# EAGLE design NanoRemotev2 (EAGLE 6.1)
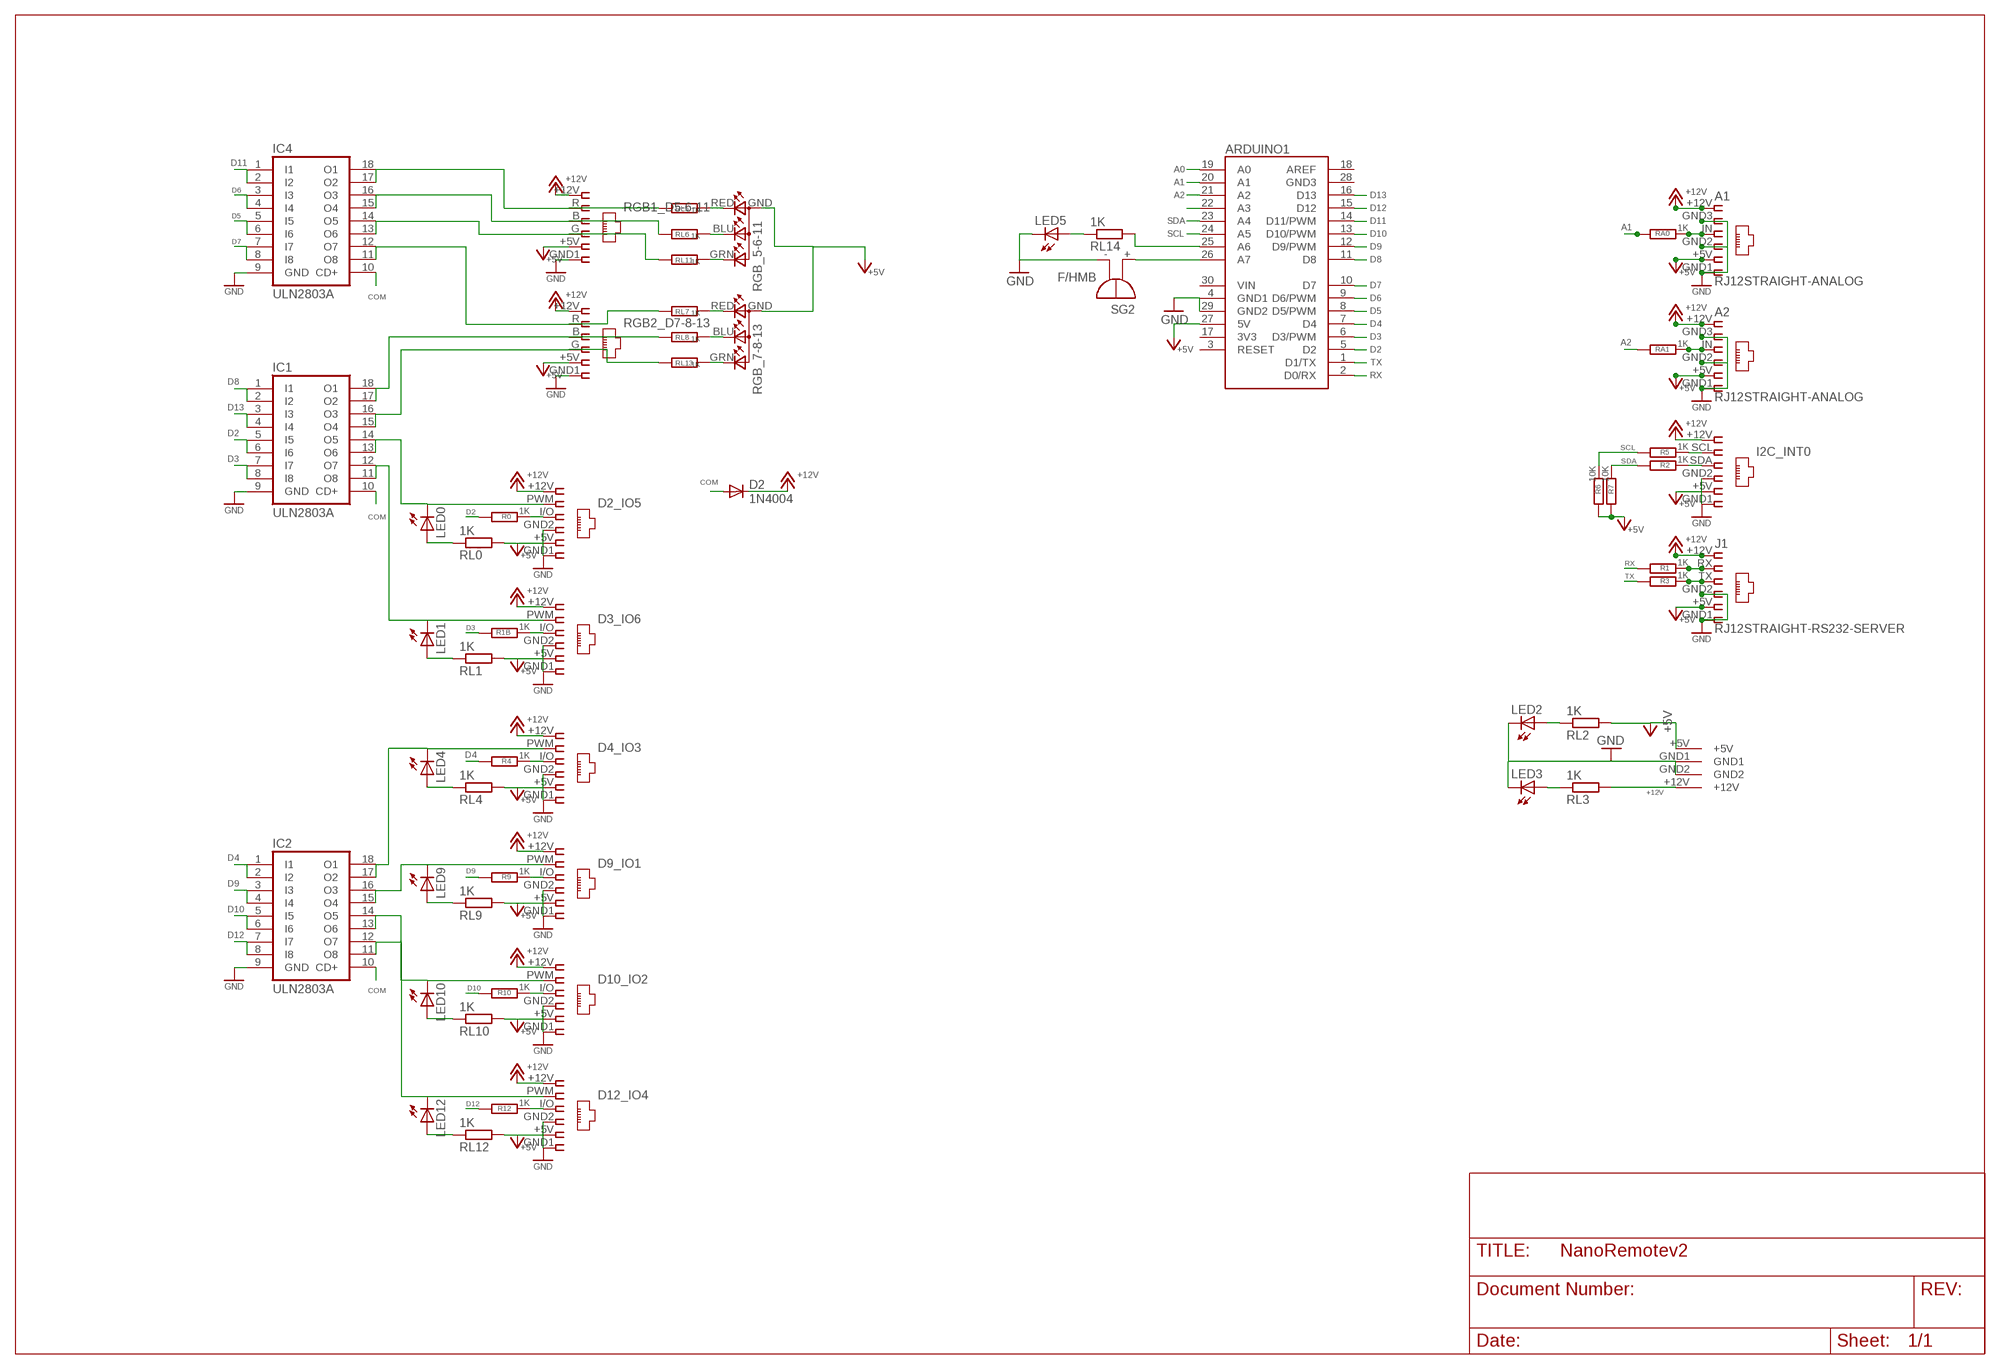
[diagram p0: schematic, sheet 1]

## Parts
A1  RJ12STRAIGHT-ANALOG  [RJ12-STRAIGHT-ANALOG]
A2  RJ12STRAIGHT-ANALOG  [RJ12-STRAIGHT-ANALOG]
ARDUINO1  ARDUINO_NANO  [ARDUINO_NANO]
D2  1N4004  [DO41-10]
D2_IO5  IO5  RJ12STRAIGHT  [RJ12-STRAIGHT]
D3_IO6  IO6  RJ12STRAIGHT  [RJ12-STRAIGHT]
D4_IO3  IO3  RJ12STRAIGHT  [RJ12-STRAIGHT]
D9_IO1  IO1  RJ12STRAIGHT  [RJ12-STRAIGHT]
D10_IO2  IO2  RJ12STRAIGHT  [RJ12-STRAIGHT]
D12_IO4  IO4  RJ12STRAIGHT  [RJ12-STRAIGHT]
I2C_INT0  I2C  RJ12STRAIGHT-I2C  [RJ12-STRAIGHT-I2C]
IC1  ULN2803A  [SO18W]
IC2  ULN2803A  [SO18W]
IC4  ULN2803A  [SO18W]
J1  RJ12STRAIGHT-RS232-SERVER  [RJ12-STRAIGHT-RS232]
LED0  LED3MM  [LED3MM]
LED1  LED3MM  [LED3MM]
LED2  LED3MM  [LED3MM]
LED3  LED3MM  [LED3MM]
LED4  LED3MM  [LED3MM]
LED5  LED3MM  [LED3MM]
LED9  LED3MM  [LED3MM]
LED10  LED3MM  [LED3MM]
LED12  LED3MM  [LED3MM]
R0  1K  R-EU_M1206  [M1206]
R1  1K  R-EU_M1206  [M1206]
R1B  1K  R-EU_M1206  [M1206]
R2  1K  R-EU_M1206  [M1206]
R3  1K  R-EU_M1206  [M1206]
R4  1K  R-EU_M1206  [M1206]
R5  1K  R-EU_M1206  [M1206]
R6  10K  R-EU_M1206  [M1206]
R7  10K  R-EU_M1206  [M1206]
R9  1K  R-EU_M1206  [M1206]
R10  1K  R-EU_M1206  [M1206]
R12  1K  R-EU_M1206  [M1206]
RA0  1K  R-EU_M1206  [M1206]
RA1  1K  R-EU_M1206  [M1206]
RGB1_D5-6-11  RGB1  RJ12STRAIGHT-RGB  [RJ12-STRAIGHT-RGB]
RGB2_D7-8-13  RGB2  RJ12STRAIGHT-RGB  [RJ12-STRAIGHT-RGB]
RGB_5-6-11  TOPLED-3  [LED-TRICOLOR-THROUGHHOLE]
RGB_7-8-13  TOPLED-3  [LED-TRICOLOR-THROUGHHOLE]
RL0  1K  R-EU_M1206  [M1206]
RL1  1K  R-EU_M1206  [M1206]
RL2  1K  R-EU_M1206  [M1206]
RL3  1K  R-EU_M1206  [M1206]
RL4  1K  R-EU_M1206  [M1206]
RL5  1K  R-EU_M1206  [M1206]
RL6  1K  R-EU_M1206  [M1206]
RL7  1K  R-EU_M1206  [M1206]
RL8  1K  R-EU_M1206  [M1206]
RL9  1K  R-EU_M1206  [M1206]
RL10  1K  R-EU_M1206  [M1206]
RL11  1K  R-EU_M1206  [M1206]
RL12  1K  R-EU_M1206  [M1206]
RL13  1K  R-EU_M1206  [M1206]
RL14  1K  R-EU_M1206  [M1206]
SG2  F/HMB  [F/HMB]
U$1  KPJX-4S-S  [KPJX-4S-S]

## Nets
+5V [highpower]: A1.+5V A2.+5V ARDUINO1.27(5V) D2_IO5.+5V D3_IO6.+5V D4_IO3.+5V D9_IO1.+5V D10_IO2.+5V D12_IO4.+5V I2C_INT0.+5V J1.+5V R6.2 R7.2 RGB1_D5-6-11.+5V RGB2_D7-8-13.+5V RGB_5-6-11.GND(A2) RGB_7-8-13.GND(A2) RL0.2 RL1.2 RL2.2 RL4.2 RL9.2 RL10.2 RL12.2 U$1.+5V
+12V [highpower]: A1.+12V A2.+12V D2.C D2_IO5.+12V D3_IO6.+12V D4_IO3.+12V D9_IO1.+12V D10_IO2.+12V D12_IO4.+12V I2C_INT0.+12V J1.+12V RGB1_D5-6-11.+12V RGB2_D7-8-13.+12V RL3.2 U$1.+12V
A0: ARDUINO1.19(A0)
A1: ARDUINO1.20(A1) RA0.2
A2: ARDUINO1.21(A2) RA1.2
COM: D2.A IC1.10(CD+) IC2.10(CD+) IC4.10(CD+)
D2: ARDUINO1.5(D2) IC1.5(I5) IC1.6(I6) R0.2
D2B: D4_IO3.I/O R4.1
D2B1: D9_IO1.I/O R9.1
D2B2: D10_IO2.I/O R10.1
D2B3: D12_IO4.I/O R12.1
D2B4: I2C_INT0.SDA R2.1
D2B5: J1.TX R3.1
D2B6: D2_IO5.I/O R0.1
D2B7: D3_IO6.I/O R1B.1
D2B8: A1.IN RA0.1
D2B9: A2.IN RA1.1
D3: ARDUINO1.6(D3/PWM) IC1.7(I7) IC1.8(I8) R1B.2
D4: ARDUINO1.7(D4) IC2.1(I1) IC2.2(I2) R4.2
D5: ARDUINO1.8(D5/PWM) IC4.5(I5) IC4.6(I6)
D6: ARDUINO1.9(D6/PWM) IC4.3(I3) IC4.4(I4)
D7: ARDUINO1.10(D7) IC4.7(I7) IC4.8(I8)
D8: ARDUINO1.11(D8) IC1.1(I1) IC1.2(I2)
D9: ARDUINO1.12(D9/PWM) IC2.3(I3) IC2.4(I4) R9.2
D10: ARDUINO1.13(D10/PWM) IC2.5(I5) IC2.6(I6) R10.2
D11: ARDUINO1.14(D11/PWM) IC4.1(I1) IC4.2(I2)
D12: ARDUINO1.15(D12) IC2.7(I7) IC2.8(I8) R12.2
D13: ARDUINO1.16(D13) IC1.3(I3) IC1.4(I4)
GND [highpower]: A1.GND1 A1.GND2 A1.GND3 A2.GND1 A2.GND2 A2.GND3 ARDUINO1.4(GND1) ARDUINO1.29(GND2) D2_IO5.GND1 D2_IO5.GND2 D3_IO6.GND1 D3_IO6.GND2 D4_IO3.GND1 D4_IO3.GND2 D9_IO1.GND1 D9_IO1.GND2 D10_IO2.GND1 D10_IO2.GND2 D12_IO4.GND1 D12_IO4.GND2 I2C_INT0.GND1 I2C_INT0.GND2 IC1.9(GND) IC2.9(GND) IC4.9(GND) J1.GND1 J1.GND2 LED2.K(C) LED3.K(C) LED5.K(C) RGB1_D5-6-11.GND1 RGB2_D7-8-13.GND1 SG2.- U$1.GND1 U$1.GND2
N$1: RGB_5-6-11.RED(CRED) RL5.2
N$2: RGB_5-6-11.BLU(CBLUE) RL6.2
N$3 [power]: IC1.17(O2) IC1.18(O1) RGB2_D7-8-13.B RL8.1
N$4: RGB_5-6-11.GRN(CGREEN) RL11.2
N$5 [power]: IC4.17(O2) IC4.18(O1) RGB1_D5-6-11.R RL5.1
N$6 [power]: IC4.15(O4) IC4.16(O3) RGB1_D5-6-11.B RL6.1
N$7: J1.RX R1.1
N$8: I2C_INT0.SCL R5.1
N$9: RGB_7-8-13.RED(CRED) RL7.2
N$10: LED5.A RL14.1
N$11: RGB_7-8-13.BLU(CBLUE) RL8.2
N$12: LED9.A RL9.1
N$13: LED3.A RL3.1
N$14: RGB_7-8-13.GRN(CGREEN) RL13.2
N$15: LED4.A RL4.1
N$16: ARDUINO1.22(A3)
N$17 [power]: IC4.13(O6) IC4.14(O5) RGB1_D5-6-11.G RL11.1
N$18 [power]: D4_IO3.PWM IC2.17(O2) IC2.18(O1) LED4.K(C)
N$19 [power]: IC4.11(O8) IC4.12(O7) RGB2_D7-8-13.R RL7.1
N$20: ARDUINO1.25(A6) RL14.2
N$21: LED10.A RL10.1
N$22: ARDUINO1.26(A7) SG2.+
N$23: LED2.A RL2.1
N$24 [power]: D10_IO2.PWM IC2.13(O6) IC2.14(O5) LED10.K(C)
N$28: LED12.A RL12.1
N$29 [power]: IC1.15(O4) IC1.16(O3) RGB2_D7-8-13.G RL13.1
N$35 [power]: D3_IO6.PWM IC1.11(O8) IC1.12(O7) LED1.K(C)
N$38: LED0.A RL0.1
N$40 [power]: D2_IO5.PWM IC1.13(O6) IC1.14(O5) LED0.K(C)
N$41: LED1.A RL1.1
N$42 [power]: D9_IO1.PWM IC2.15(O4) IC2.16(O3) LED9.K(C)
N$44 [power]: D12_IO4.PWM IC2.11(O8) IC2.12(O7) LED12.K(C)
RX: ARDUINO1.2(D0/RX) R1.2
SCL: ARDUINO1.24(A5) R5.2 R6.1
SDA: ARDUINO1.23(A4) R2.2 R7.1
TX: ARDUINO1.1(D1/TX) R3.2
Unconnected: ARDUINO1.3(RESET) ARDUINO1.18(AREF) ARDUINO1.28(GND3) ARDUINO1.30(VIN)

## Power pins joined to a net without a drawn wire
3V3: ARDUINO1.17(3V3)

## Library data of the parts
A1 A2 D2_IO5 D3_IO6 D4_IO3 D9_IO1 D10_IO2 D12_IO4 I2C_INT0 J1 RGB1_D5-6-11 RGB2_D7-8-13 = lpatiny:RJ12: CORCOM Modular RJ Jacks No Shield Source: www.tycoelectronics.com .. ENG_DS_1654001_1099_RJ_L_0507.pdf
ARDUINO1 = arduino:ARDUINO_NANO: Arduino Nano I/O pin arrangement
D2 = diode:1N4004: DIODE general purpose rectifier, 1 A
IC1 IC2 IC4 = lpatiny:ULN2803A: DRIVER ARRAY
LED0 LED1-LED5 LED9 LED10 LED12 = lpatiny:LED3MM
R0 R1 R1B R2-R7 R9 R10 R12 RA0 RA1 RL0 RL1-RL14 = resistor:R-EU_: RESISTOR, European symbol
RGB_5-6-11 RGB_7-8-13 = lpatiny:TOPLED-3: OSRAM - Hyper Multi TOPLED® (RGB) LB E673, LV E673, LT E673 - Power TOPLED® Enhanced optical Power LED (HOP2000) LS E67B, LA E67B, LO E67B, LY E67B - Hyper Multi TOPLED® Enhanced optical Power LED (HOP2000 / ATON®) LATB T66B - Hyper Multi TOPLED® Hyper-Bright LED LATB T686 Source: http://www.osram.convergy.de/
SG2 = buzzer:F/HMB: BUZZER Source: Buerklin; OC_FARNELL: unknown; OC_NEWARK: unknown
U$1 = lpatiny:KPJX-4S-S

## Net classes
0 default: width 0.457 mm
1 power: width 0.914 mm
2 highpower: width 1.372 mm

## Board
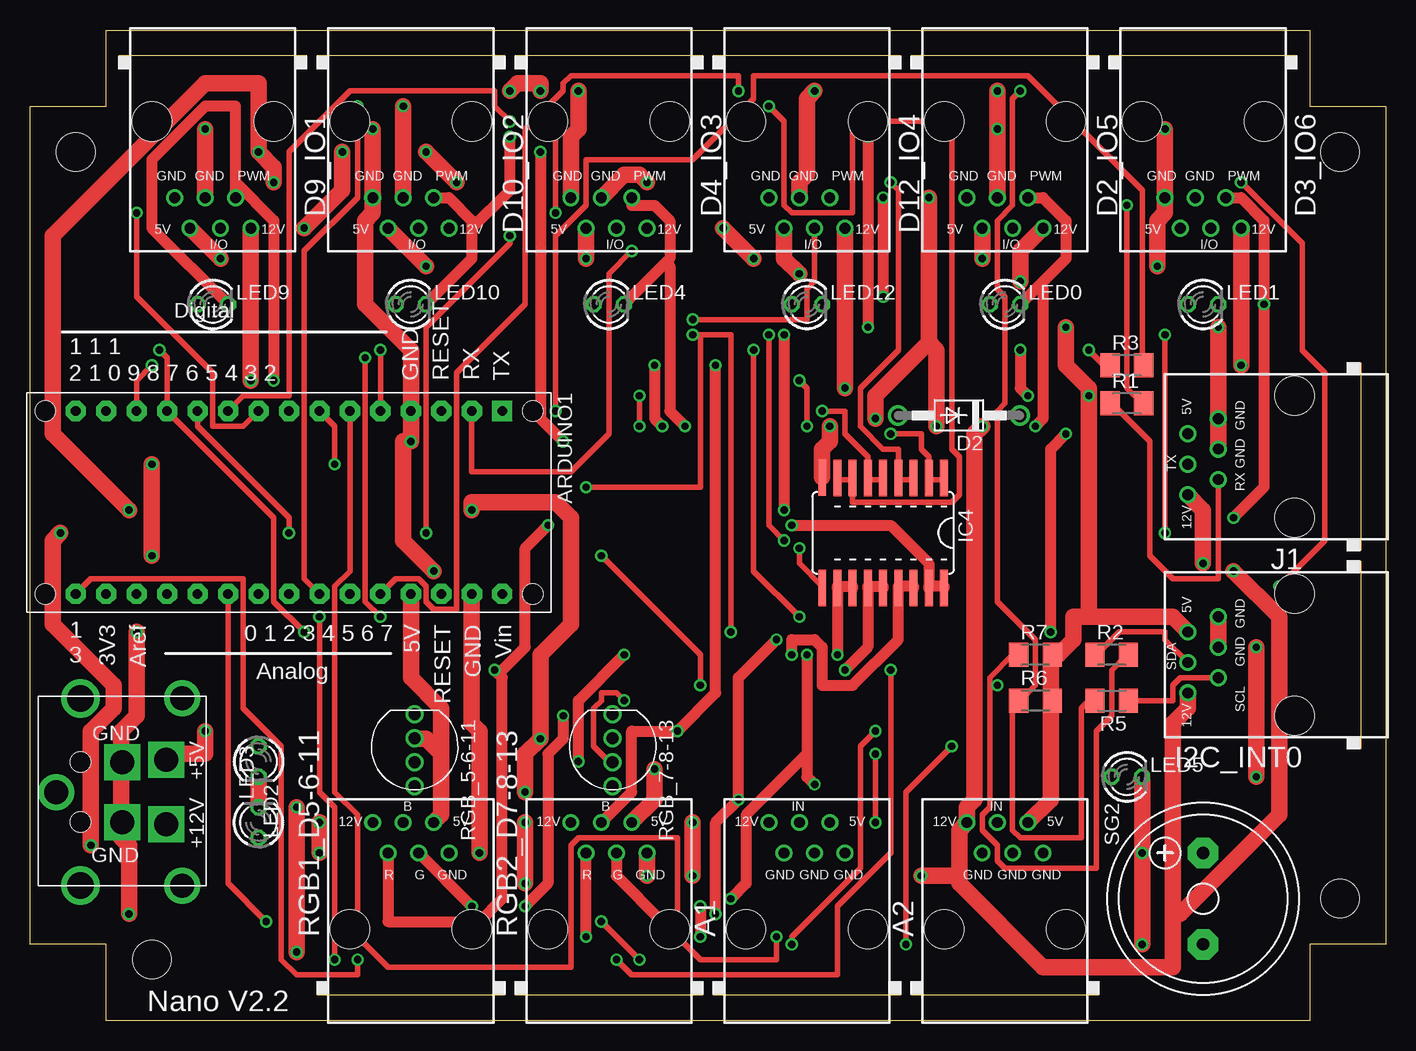
[diagram p1: board, top side]
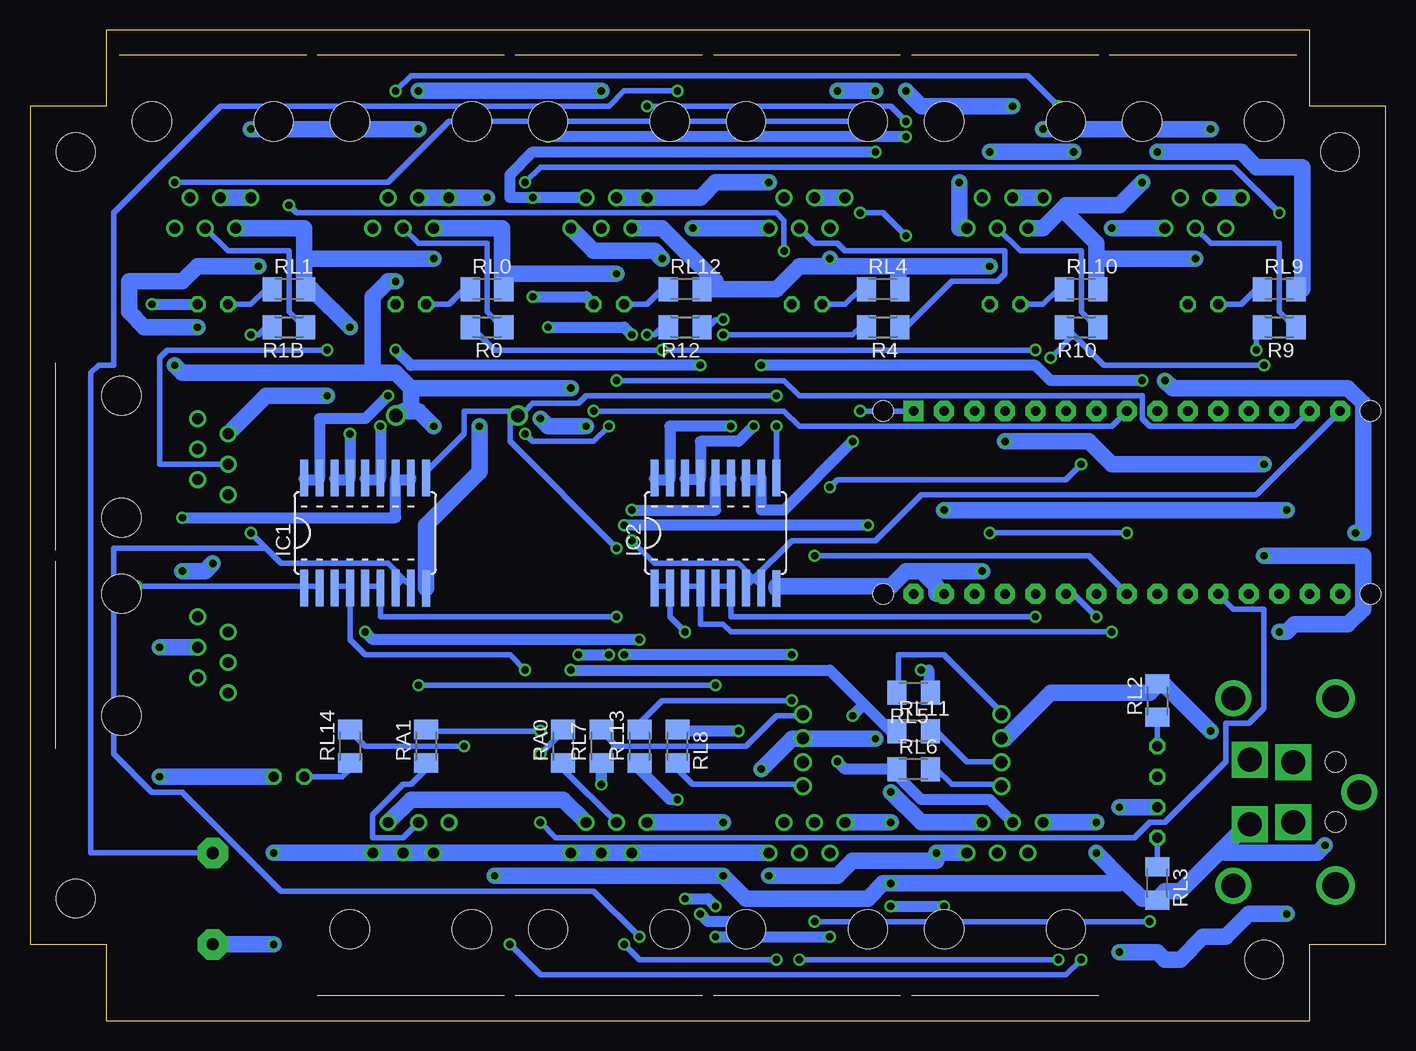
[diagram p2: board, bottom side, seen from below]

Size 113.03 x 82.55 mm. Coordinates in mm from the lower left corner, seen from the top.
Outline: 6.35,82.55 106.68,82.55 106.68,76.2 113.03,76.2 113.03,6.35 106.68,6.35 106.68,0 6.35,0 6.35,6.35 0,6.35 0,76.2 6.35,76.2 6.35,82.55
Copper layers (1*16): Top 0.035mm / dielectric 1.5mm / Bottom 0.035mm
Design rules: minimum track width 10mil, minimum drill 24mil, track to track 8mil, track to pad 8mil, pad to pad 8mil, via to via 8mil, smd to smd 8mil, copper to edge 40mil, drill to drill 8mil, minimum pad ring 10mil, minimum via ring 8mil, stop-mask expansion 4mil, vias tented up to drill 0mil, thermal gap 10mil
Holes 3.2 mm at 3.81,72.39 10.16,5.08 109.22,10.16 109.22,72.39
tRestrict: area 106.7,57.1 to 113,68.6
bRestrict: area 106.7,57.1 to 113,68.6
vRestrict: area 49.5,33 to 62.2,48.3; area 64.8,33 to 77.5,48.3; area 78.7,33 to 91.4,48.3; area 106.7,57.1 to 113,68.6
Milling: 12 lines

### Footprints (pad centres in the part's own frame; a part is rotated, then mirrored left to right if it is on the bottom)
RJ12-STRAIGHT-ANALOG = drill 0.9 pad 1.4: +5V 1.905,8.89; +12V -3.175,8.89; GND1 3.175,6.35; GND2 0.635,6.35; GND3 -1.905,6.35; IN -0.635,8.89 | hole 3.251: -5.08,0; 5.08,0
ARDUINO_NANO = drill 0.8 pad 1.676 square: 1 0,-2.54 | drill 0.8 pad 1.676 octagon: 2 0,-5.08; 3 0,-7.62; 4 0,-10.16; 5 0,-12.7; 6 0,-15.24; 7 0,-17.78; 8 0,-20.32; 9 0,-22.86; 10 0,-25.4; 11 0,-27.94; 12 0,-30.48; 13 0,-33.02; 14 0,-35.56; 15 0,-38.1; 16 15.24,-38.1; 17 15.24,-35.56; 18 15.24,-33.02; 19 15.24,-30.48; 20 15.24,-27.94; 21 15.24,-25.4; 22 15.24,-22.86; 23 15.24,-20.32; 24 15.24,-17.78; 25 15.24,-15.24; 26 15.24,-12.7; 27 15.24,-10.16; 28 15.24,-7.62; 29 15.24,-5.08; 30 15.24,-2.54 | hole 1.676: 0,0; 0,-40.64; 15.24,-40.64; 15.24,0
DO41-10 = drill 1.118: A 5.08,0; C -5.08,0
RJ12-STRAIGHT@1 = drill 0.9 pad 1.4: +5V 1.905,8.89; +12V -3.175,8.89; GND1 3.175,6.35; GND2 0.635,6.35; I/O -0.635,8.89; PWM -1.905,6.35 | hole 3.251: -5.08,0; 5.08,0
RJ12-STRAIGHT-I2C@1 = drill 0.9 pad 1.4: +5V 1.905,8.89; +12V -3.175,8.89; GND1 3.175,6.35; GND2 0.635,6.35; SCL -1.905,6.35; SDA -0.635,8.89 | hole 3.251: -5.08,0; 5.08,0
SO18W = smd 0.66 x 3.048: 1 -5.08,-4.585; 2 -3.81,-4.585; 3 -2.54,-4.585; 4 -1.27,-4.585; 5 0,-4.585; 6 1.27,-4.585; 7 2.54,-4.585; 8 3.81,-4.585; 9 5.08,-4.623; 10 5.08,4.585; 11 3.81,4.585; 12 2.54,4.585; 13 1.27,4.585; 14 0,4.585; 15 -1.27,4.585; 16 -2.54,4.585; 17 -3.81,4.585; 18 -5.08,4.585
RJ12-STRAIGHT-RS232 = drill 0.9 pad 1.4: +5V 1.905,8.89; +12V -3.175,8.89; GND1 3.175,6.35; GND2 0.635,6.35; RX -1.905,6.35; TX -0.635,8.89 | hole 3.251: -5.08,0; 5.08,0
LED3MM = drill 0.813 octagon: A -1.27,0; K 1.27,0
M1206 = smd 1.6 x 2: 1 -1.4,0; 2 1.4,0
RJ12-STRAIGHT-RGB@1 = drill 0.9 pad 1.4: +5V 1.905,8.89; +12V -3.175,8.89; B -0.635,8.89; G 0.635,6.35; GND1 3.175,6.35; R -1.905,6.35 | hole 3.251: -5.08,0; 5.08,0
LED-TRICOLOR-THROUGHHOLE = drill 1: BLU 3,0; GND -1,0; GRN 1,0; RED -3,0
F/HMB = drill 1.016 pad 2.54 octagon: + 3.81,0; - -3.81,0
KPJX-4S-S = drill 2 square: +5V 2.7,1.35; +12V -2.7,1.35; GND1 -2.5,5; GND2 2.5,5 | drill 2: P$1 -7.8,0; P$2 7.8,0; P$11 0,10.5 | drill 2.2: P$3 -7.8,8.5; P$4 7.8,8.5 | hole 1.7: -2.5,8.5; 2.5,8.5

### Placement (x,y rotation side)
A1  64.77,7.62 0 top
A2  81.28,7.62 0 top
ARDUINO1  41.91,50.8 270 top
D2  77.44,50.43 180 top
D2_IO5  IO5  [RJ12-STRAIGHT@1]  81.28,74.93 180 top
D3_IO6  IO6  [RJ12-STRAIGHT@1]  97.79,74.93 180 top
D4_IO3  IO3  [RJ12-STRAIGHT@1]  48.26,74.93 180 top
D9_IO1  IO1  [RJ12-STRAIGHT@1]  15.24,74.93 180 top
D10_IO2  IO2  [RJ12-STRAIGHT@1]  31.75,74.93 180 top
D12_IO4  IO4  [RJ12-STRAIGHT@1]  64.77,74.93 180 top
I2C_INT0  I2C  [RJ12-STRAIGHT-I2C@1]  105.41,30.48 90 top
IC1  85.09,40.64 0 bottom
IC2  55.88,40.64 0 bottom
IC4  71.12,40.64 180 top
J1  105.41,46.99 90 top
LED0  81.28,59.69 0 top
LED1  97.79,59.69 0 top
LED2  19.05,21.59 270 top
LED3  19.05,16.51 90 top
LED4  48.26,59.69 0 top
LED5  91.44,20.32 0 top
LED9  15.24,59.69 0 top
LED10  31.75,59.69 0 top
LED12  64.77,59.69 0 top
R0  74.93,57.78 180 bottom
R1  91.44,51.44 0 top
R1B  91.44,57.78 180 bottom
R2  90.17,30.48 0 top
R3  91.44,54.61 0 top
R4  41.91,57.78 180 bottom
R5  90.17,26.67 180 top
R6  83.82,26.67 0 top
R7  83.82,30.48 0 top
R9  8.89,57.78 180 bottom
R10  25.4,57.78 180 bottom
R12  58.42,57.78 180 bottom
RA0  68.58,22.86 90 bottom
RA1  80.01,22.86 90 bottom
RGB1_D5-6-11  RGB1  [RJ12-STRAIGHT-RGB@1]  31.75,7.62 0 top
RGB2_D7-8-13  RGB2  [RJ12-STRAIGHT-RGB@1]  48.26,7.62 0 top
RGB_5-6-11  32.07,22.54 270 top
RGB_7-8-13  48.58,22.54 270 top
RL0  74.93,60.96 0 bottom
RL1  91.44,60.96 0 bottom
RL2  19.05,26.67 90 bottom
RL3  19.05,11.43 270 bottom
RL4  41.91,60.96 0 bottom
RL5  39.37,27.3 180 bottom
RL6  39.37,20.95 0 bottom
RL7  65.41,22.86 90 bottom
RL8  59.05,22.86 270 bottom
RL9  8.89,60.96 0 bottom
RL10  25.4,60.96 0 bottom
RL11  39.37,24.13 0 bottom
RL12  58.42,60.96 0 bottom
RL13  62.23,22.86 90 bottom
RL14  86.36,22.86 90 bottom
SG2  97.79,10.16 90 top
U$1  12.7,19.05 90 top

### Tracks (layer width: path | path; a pad name or v marks a point on that pad's centre or on a via)
+5V  (via drill 0.61)
  Top 1.372: I2C_INT0.+5V 95.25,33.66 88.27,33.66 | 88.27,33.66 86.99,33.66 86.99,31.75 85.72,30.48 R7.2 85.09,30.48 85.09,26.67 R6.2 85.09,26.04 85.09,18.41 A2.+5V | 88.27,33.66 v88.27,52.07 88.27,52.7 86.36,54.61 v86.36,57.78 | RGB2_D7-8-13.+5V 52.07,18.41 v52.07,20.95 | RGB1_D5-6-11.+5V 34.29,17.14 34.29,22.23 | 34.29,22.23 33.02,23.5 32.38,23.5 RGB_5-6-11.GND | ARDUINO1.27 31.75,28.57 34.29,26.04 34.29,22.23 | v41.28,19.05 41.28,22.23 v42.55,23.5 42.55,30.48 45.09,33.02 45.09,41.91 43.82,43.18 36.83,43.18 v36.83,42.55 | v14.61,24.13 14.61,22.23 11.43,22.23 U$1.+5V | v79.38,63.5 D2_IO5.+5V | v46.36,63.5 D4_IO3.+5V | v20.32,69.85 20.32,71.12 v19.05,72.39 19.05,78.11 14.61,78.11 1.91,65.41 1.91,48.9 v8.26,42.55 | v15.88,63.5 D9_IO1.+5V | D10_IO2.+5V v33.02,62.87 | v64.14,62.23 62.87,63.5 D12_IO4.+5V
  Bottom 1.372: A1.+5V 68.58,18.41 81.28,18.41 A2.+5V | J1.+5V 93.34,52.07 v88.27,52.07 | v52.07,20.95 49.53,23.5 48.9,23.5 RGB_7-8-13.GND 48.26,23.5 v42.55,23.5 | RGB_5-6-11.GND 31.75,23.5 27.94,27.3 19.68,27.3 19.05,27.94 RL2.2 18.41,27.94 v14.61,24.13 | v41.28,19.05 38.74,16.51 RGB1_D5-6-11.+5V | 73.66,62.23 73.66,66.04 D2_IO5.+5V | 73.66,62.23 73.66,60.96 RL0.2 | 90.17,63.5 90.17,66.04 D3_IO6.+5V | 90.17,63.5 90.17,60.96 RL1.2 89.53,60.96 v86.36,57.78 | 90.17,63.5 v79.38,63.5 | 40.64,62.87 40.64,60.96 RL4.2 | 46.36,62.87 48.9,62.87 50.8,60.96 55.88,60.96 | 46.36,62.87 40.64,62.87 | RL12.2 55.88,60.96 | v46.36,63.5 46.36,62.87 | D12_IO4.+5V 60.33,66.04 55.88,61.59 55.88,60.96 | v19.05,72.39 12.06,72.39 10.79,71.12 6.98,71.12 6.98,60.96 RL9.2 | v20.32,69.85 22.22,67.94 26.67,67.94 | 26.67,67.94 28.57,66.04 D10_IO2.+5V | 24.13,63.5 24.13,64.77 26.67,67.31 26.67,67.94 | 24.13,63.5 24.13,60.96 RL10.2 | 24.13,63.5 v15.88,63.5 | v33.02,62.87 40.64,62.87 | v64.14,62.23 73.66,62.23 | v8.26,42.55 v36.83,42.55
+12V  (via drill 0.61)
  Top 1.372: v60.33,63.5 v57.79,66.04 | D2_IO5.+12V 82.55,64.14 v82.55,61.59 | v100.96,54.61 D3_IO6.+12V | v67.94,52.7 D12_IO4.+12V | 77.47,12.06 77.47,11.43 84.45,4.45 95.25,4.45 95.25,8.89 | 77.47,12.06 77.47,15.88 A2.+12V 78.1,17.78 78.74,18.41 78.74,48.9 v79.38,49.53 | 95.25,8.89 95.25,24.77 96.52,26.04 I2C_INT0.+12V | J1.+12V 97.79,42.55 v97.79,38.1 | v100.33,37.47 104.14,33.66 104.14,17.14 95.88,8.89 95.25,8.89 | v22.86,66.04 26.04,69.22 v26.04,72.39 | v35.56,69.85 v33.02,72.39 | v24.13,13.97 v24.13,16.51 | v41.28,11.43 v41.28,16.51 | v55.25,12.06 v55.25,16.51 | v18.41,53.34 D9_IO1.+12V | v2.54,40.64 1.91,40.01 1.91,33.02 6.98,27.94 6.98,26.04 5.08,24.13 v5.08,14.61 | v74.3,12.06 77.47,12.06
  Bottom 1.372: v57.79,66.04 D4_IO3.+12V | v60.33,63.5 60.96,64.14 66.04,64.14 D12_IO4.+12V | v82.55,61.59 83.19,61.59 84.45,60.33 84.45,53.98 | 84.45,53.98 82.55,53.98 81.28,52.7 | 81.28,50.8 81.28,52.7 | 81.28,50.8 81.91,50.8 D2.C | v100.96,54.61 100.33,53.98 84.45,53.98 | 81.28,52.7 v67.94,52.7 | v97.79,38.1 98.42,37.47 v100.33,37.47 | v22.86,66.04 D9_IO1.+12V | v33.02,72.39 v26.04,72.39 | v35.56,69.85 35.56,66.04 D10_IO2.+12V | 13.65,14.29 12.06,15.88 11.43,15.88 U$1.+12V | 13.65,14.29 17.14,10.79 18.41,10.79 19.05,10.16 RL3.2 19.68,10.16 20.32,10.16 21.91,11.75 | v24.13,16.51 RGB1_D5-6-11.+12V | 21.91,11.75 v24.13,13.97 | v41.28,16.51 RGB2_D7-8-13.+12V | 21.91,11.75 22.22,11.43 v41.28,11.43 41.91,11.43 43.18,10.16 53.34,10.16 v55.25,12.06 v74.3,12.06 | v55.25,16.51 A1.+12V | v18.41,53.34 17.78,52.7 3.17,52.7 1.91,51.44 1.91,40.64 v2.54,40.64 | v5.08,14.61 5.71,13.97 13.33,13.97 13.65,14.29 | v79.38,49.53 80.64,50.8 81.28,50.8
A1  (via drill 0.61)
  Top 0.457: v70.48,16.51 v70.48,22.23
  Bottom 0.457: v70.48,22.23 68.58,24.13 RA0.2 | v70.48,16.51 69.21,15.24 20.95,15.24 19.68,16.51 18.41,16.51 13.33,21.59 13.33,24.77 11.43,24.77 10.16,26.04 10.16,34.29 12.7,34.29 ARDUINO1.20
A2  (via drill 0.61)
  Top 0.457: v70.48,24.13 69.21,22.86 69.21,12.7 63.5,6.99 v63.5,6.35 | v47.62,8.26 v50.8,5.08 | v19.68,8.26 16.51,11.43 ARDUINO1.21
  Bottom 0.457: v70.48,24.13 80.01,24.13 RA1.2 | v63.5,6.35 62.23,5.08 v50.8,5.08 | v19.68,8.26 v47.62,8.26
COM  (via drill 0.61)
  Top 0.457: v50.8,52.07 v50.8,49.53 | v64.14,39.37 64.14,38.1 66.04,36.2 IC4.10
  Bottom 0.457: v50.8,49.53 IC2.10 | v50.8,52.07 66.67,52.07 67.31,51.44 71.12,51.44 71.75,50.8 D2.A | v64.14,39.37 73.02,48.26 73.02,50.16 72.39,50.16 D2.A | IC1.10 80.01,45.72 76.83,48.9 76.83,50.8 72.39,50.8 D2.A
D2  (via drill 0.61)
  Top 0.457: ARDUINO1.5 v29.21,55.88 | v64.14,33.66 60.33,37.47 v60.33,55.88
  Bottom 0.457: IC1.5 85.09,36.2 83.82,36.2 IC1.6 83.82,33.66 v64.14,33.66 | v29.21,55.88 v60.33,55.88 74.3,55.88 76.2,57.78 R0.2
D2B
  Bottom 0.457: D4_IO3.I/O 47.62,64.77 45.72,64.77 45.09,64.14 31.75,64.14 31.75,62.23 32.38,61.59 36.2,61.59 40.01,57.78 R4.1
D2B1
  Bottom 0.457: D9_IO1.I/O 14.61,64.77 8.89,64.77 8.89,59.05 7.62,57.78 R9.1
D2B2
  Bottom 0.457: D10_IO2.I/O 30.48,64.14 25.4,64.14 25.4,59.05 24.13,57.78 R10.1
D2B3  (via drill 0.61)
  Top 0.457: v55.25,58.42 64.77,58.42 64.77,60.96 65.41,61.59 D12_IO4.I/O
  Bottom 0.457: v55.25,58.42 55.88,58.42 56.52,57.78 R12.1
D2B4
  Top 0.457: I2C_INT0.SDA 94.61,31.75 94.61,32.38 90.8,32.38 88.9,30.48 R2.1
D2B5  (via drill 0.61)
  Top 0.457: v88.27,55.88 89.53,54.61 R3.1
  Bottom 0.457: v88.27,55.88 101.6,55.88 102.23,55.24 102.23,46.35 J1.TX
D2B6
  Bottom 0.457: D2_IO5.I/O 80.64,64.77 74.93,64.77 74.93,59.05 73.66,57.78 R0.1
D2B7
  Bottom 0.457: D3_IO6.I/O 96.52,64.14 91.44,64.14 91.44,59.05 90.17,57.78 R1B.1
D2B8
  Bottom 0.457: A1.IN 68.58,20.95 RA0.1
D2B9
  Bottom 0.457: A2.IN 81.91,15.24 84.45,15.24 84.45,17.14 81.91,19.68 81.28,19.68 80.01,20.95 RA1.1
D3  (via drill 0.61)
  Top 0.457: v94.61,40.64 v94.61,57.15 | ARDUINO1.6 26.67,37.47 25.4,36.2 25.4,19.05 27.3,17.14 27.3,6.99 29.84,4.45 45.09,4.45 45.09,14.61 45.72,15.24 53.98,15.24 53.98,6.99 55.88,5.08 62.23,5.08 v62.23,6.99
  Bottom 0.457: v94.61,57.15 93.98,57.15 93.34,57.78 R1B.2 | 93.34,39.37 92.08,38.1 83.19,38.1 81.91,36.83 | 93.34,39.37 v94.61,40.64 | 81.91,36.83 81.28,36.2 IC1.8 | 81.91,36.83 82.55,36.2 IC1.7 | v62.23,6.99 66.04,10.79 92.08,10.79 100.33,19.05 102.87,19.05 106.05,22.23 106.05,39.37 93.34,39.37
D4  (via drill 0.61)
  Top 0.457: 55.88,57.15 58.42,57.15 v58.42,32.38 | 55.88,57.15 v55.25,57.15 | ARDUINO1.7 25.4,49.53 v25.4,46.35 | v46.36,44.45 55.88,44.45 55.88,57.15
  Bottom 0.457: v55.25,57.15 44.45,57.15 43.82,57.78 R4.2 | v58.42,32.38 59.69,33.66 IC2.2 59.69,36.2 60.96,36.2 IC2.1 | v25.4,46.35 26.67,45.09 45.72,45.09 v46.36,44.45
D5  (via drill 0.61)
  Top 0.457: IC4.5 71.12,45.09 69.85,45.09 IC4.6 69.85,46.99 67.94,48.9 67.94,50.8 v66.04,50.8
  Bottom 0.457: ARDUINO1.8 22.86,49.53 48.9,49.53 50.17,50.8 v66.04,50.8
D6  (via drill 0.61)
  Top 0.457: IC4.3 73.66,45.09 72.39,45.09 IC4.4 72.39,47.62 71.12,47.62 69.21,49.53 69.21,52.7 72.39,55.88 72.39,69.22 v71.75,69.85 | ARDUINO1.9 17.78,49.53 15.24,49.53 15.24,53.98 8.89,60.33 v8.89,67.31
  Bottom 0.457: v8.89,67.31 12.7,71.12 70.48,71.12 v71.75,69.85
D7  (via drill 0.61)
  Top 0.457: 68.58,45.09 67.31,45.09 IC4.8 | ARDUINO1.10 17.78,52.07 21.59,52.07 21.59,72.39 26.67,77.47 38.74,77.47 38.74,76.2 v40.01,74.93 | v61.6,76.2 62.87,74.93 62.87,67.94 63.5,67.31 68.58,67.31 68.58,74.3 69.21,74.93 76.83,74.93 76.83,47.62 77.47,46.99 77.47,43.81 76.83,43.18 68.58,43.18 68.58,45.09 | 68.58,45.09 IC4.7
  Bottom 0.457: v40.01,74.93 41.28,76.2 v61.6,76.2
D8  (via drill 0.61)
  Top 0.457: ARDUINO1.11 13.97,49.53 21.59,41.91 v21.59,40.64 | v33.02,40.64 33.02,57.78 40.01,64.77 v40.01,65.41 | v43.82,74.93 v43.82,67.31 | v100.96,69.85 106.05,64.77 106.05,55.88 107.95,53.98 107.95,40.01 v104.14,36.2
  Bottom 0.457: 90.17,36.2 88.9,36.2 IC1.2 | v33.02,40.64 v21.59,40.64 | v40.01,65.41 41.91,67.31 v43.82,67.31 | v43.82,74.93 78.1,74.93 83.19,69.85 v100.96,69.85 | 90.17,36.2 v104.14,36.2 | 90.17,36.2 IC1.1
D9  (via drill 0.61)
  Top 0.457: v10.79,55.88 11.43,55.24 ARDUINO1.12 20.32,41.91 20.32,34.92 v22.86,32.38
  Bottom 0.457: IC2.3 58.42,36.2 57.15,36.2 IC2.4 57.15,33.02 55.25,33.02 54.61,32.38 v22.86,32.38 | v10.79,55.88 10.79,57.78 R9.2
D10  (via drill 0.61)
  Top 0.457: v10.16,54.61 8.89,53.34 ARDUINO1.13 | v29.21,33.66 27.94,34.92 v27.94,55.24
  Bottom 0.457: IC2.5 55.88,36.2 54.61,36.2 IC2.6 54.61,33.66 v29.21,33.66 | 26.04,57.15 23.5,54.61 v10.16,54.61 | 26.04,57.15 26.67,57.78 R10.2 26.04,57.15 | 26.04,57.15 v27.94,55.24
D11  (via drill 0.61)
  Top 0.457: IC4.1 76.2,45.09 74.93,45.09 IC4.2 74.93,46.99 74.3,47.62 74.3,48.9 v71.75,48.9 | v64.14,53.34 64.77,52.7 v64.77,49.53
  Bottom 0.457: ARDUINO1.14 7.62,49.53 19.68,49.53 20.32,50.16 20.32,52.07 48.9,52.07 50.17,53.34 v64.14,53.34 | v64.77,49.53 66.04,48.26 71.12,48.26 v71.75,48.9
D12  (via drill 0.61)
  Top 0.457: v61.6,57.15 61.6,41.27 v62.87,40.01
  Bottom 0.457: v61.6,57.15 60.96,57.15 60.33,57.78 R12.2 | v62.87,40.01 60.96,38.1 53.98,38.1 52.71,36.83 | 52.71,36.83 52.07,36.2 IC2.8 | 52.71,36.83 53.34,36.2 IC2.7 | ARDUINO1.15 10.79,43.81 38.74,43.81 42.55,40.01 49.53,40.01 52.71,36.83
D13  (via drill 0.61)
  Top 0.457: ARDUINO1.16 5.08,36.83 17.78,36.83 17.78,26.04 20.95,22.86 20.95,5.08 22.22,3.81 27.3,3.81 v27.3,5.08 | v48.9,5.08 50.17,3.81 67.31,3.81 67.31,9.53 71.75,13.97 v71.75,29.21
  Bottom 0.457: IC1.3 87.63,36.2 86.36,36.2 IC1.4 86.36,31.75 85.09,30.48 73.02,30.48 v71.75,29.21 | v48.9,5.08 v27.3,5.08
GND  (via drill 0.61)
  Top 1.372: v37.47,13.97 37.47,24.13 36.83,24.77 ARDUINO1.29 | I2C_INT0.GND1 I2C_INT0.GND2 | LED5.K v92.71,13.97 v92.71,6.35 | v102.23,20.32 v102.23,31.11 | RGB2_D7-8-13.GND1 v51.44,12.06 | LED2.K LED3.K | v22.22,5.71 v22.22,17.78 | v8.26,8.89 8.26,14.61 7.62,15.24 7.62,16.51 U$1.GND1 7.62,17.14 7.62,20.95 U$1.GND2 7.62,22.23 7.62,24.13 8.89,25.4 v8.89,32.38 | v14.61,74.3 D9_IO1.GND2 | v28.57,74.3 D10_IO2.GND1 28.57,67.31 27.94,66.67 27.94,59.69 31.75,55.88 ARDUINO1.4 v31.75,48.26 31.11,48.26 31.11,40.01 v33.66,37.47 | v10.16,46.35 v10.16,38.73 | D4_IO3.GND2 49.53,70.48 50.8,70.48 v51.44,69.85 | J1.GND2 J1.GND1 v99.06,57.78 | v75.56,49.53 75.56,55.88 74.93,56.52 | v74.93,68.58 74.93,56.52 | IC4.9 66.04,47.62 66.67,48.26 v66.67,49.53 | v70.48,50.16 70.48,52.07 74.93,56.52 | v94.61,74.3 D3_IO6.GND1 94.61,67.31 93.98,66.67 v93.98,62.87 | D2_IO5.GND2 v80.64,74.3 v80.64,77.47 | D12_IO4.GND2 64.14,69.85 64.77,70.48 64.77,76.83 v65.41,77.47 | v31.11,76.2 D10_IO2.GND2 | v40.01,77.47 40.64,78.11 42.55,78.11 v42.55,77.47 | v45.72,77.47 45.72,74.3 45.09,73.66 D4_IO3.GND1
  Bottom 1.372: RGB1_D5-6-11.GND1 v37.47,13.97 37.47,13.34 44.45,13.34 45.72,12.06 v51.44,12.06 | 38.74,37.47 40.01,37.47 41.28,36.2 50.8,36.2 IC2.9 | 38.74,37.47 37.47,36.2 37.47,35.56 ARDUINO1.29 | RGB2_D7-8-13.GND1 A1.GND3 A1.GND2 A1.GND1 A2.GND3 A2.GND2 A2.GND1 v92.71,13.97 | v102.23,31.11 I2C_INT0.GND2 | LED5.K v102.23,20.32 | v92.71,6.35 SG2.- | v22.22,17.78 LED3.K | v22.22,5.71 19.05,5.71 18.41,5.08 17.14,5.08 15.24,6.99 13.33,6.99 11.43,8.89 v8.26,8.89 | D9_IO1.GND2 D9_IO1.GND1 | D10_IO2.GND2 D10_IO2.GND1 | v28.57,74.3 v14.61,74.3 | v8.89,32.38 8.26,32.38 7.62,33.02 3.17,33.02 1.91,34.29 1.91,38.73 v10.16,38.73 | v10.16,46.35 22.86,46.35 24.77,48.26 v31.75,48.26 | D4_IO3.GND2 D4_IO3.GND1 | D12_IO4.GND2 D12_IO4.GND1 57.15,68.58 55.88,69.85 v51.44,69.85 | D3_IO6.GND2 D3_IO6.GND1 | D2_IO5.GND2 D2_IO5.GND1 v74.93,68.58 | IC1.9 80.01,41.27 75.56,45.72 v75.56,49.53 | v66.67,49.53 69.85,49.53 v70.48,50.16 | v80.64,74.3 v94.61,74.3 | v99.06,57.78 103.5,57.78 104.77,59.05 104.77,61.59 100.33,61.59 99.06,62.87 v93.98,62.87 | v80.64,77.47 v65.41,77.47 | v31.11,76.2 38.74,76.2 v40.01,77.47 | v45.72,77.47 v42.55,77.47 | v33.66,37.47 38.74,37.47
N$1
  Bottom 0.457: RL5.2 40.64,27.3 40.64,30.48 36.83,30.48 32.38,26.04 RGB_5-6-11.RED
N$2
  Bottom 0.457: RL6.2 37.47,20.95 36.2,19.68 32.38,19.68 RGB_5-6-11.BLU
N$3  (via drill 0.61)
  Top 0.914: RGB2_D7-8-13.B 50.17,19.05 50.17,24.13 v53.98,24.13 57.15,27.3 v57.15,54.61 | v83.19,52.07 82.55,52.7 v82.55,55.88
  Bottom 0.914: IC1.18 90.17,45.09 88.9,45.09 IC1.17 88.9,50.16 85.09,50.16 v83.19,52.07 | v53.98,24.13 59.05,24.13 RL8.1 | v82.55,55.88 81.28,54.61 v57.15,54.61
N$4
  Bottom 0.457: RL11.2 37.47,24.13 34.93,21.59 32.38,21.59 RGB_5-6-11.GRN
N$5  (via drill 0.61)
  Top 0.914: 74.93,36.2 76.2,36.2 IC4.18 | 39.05,28.89 39.37,28.57 39.37,10.16 37.47,8.26 29.84,8.26 RGB1_D5-6-11.R | 39.05,28.89 v38.74,29.21 | 74.93,36.2 74.93,38.1 71.75,41.27 v63.5,41.27 | v43.18,41.27 41.28,39.37 41.28,31.11 39.05,28.89 | 74.93,36.2 IC4.17
  Bottom 0.914: v38.74,29.21 38.1,29.21 38.1,27.3 RL5.1 | v43.18,41.27 v63.5,41.27
N$6  (via drill 0.61)
  Top 0.914: IC4.16 73.66,36.2 72.39,36.2 IC4.15 72.39,31.75 68.58,27.94 66.04,27.94 66.04,31.11 65.41,31.75 63.5,31.75 v63.5,30.48 | v49.53,30.48 45.72,26.67 v45.72,21.59
  Bottom 0.914: RGB1_D5-6-11.B 33.02,18.41 38.74,18.41 40.64,20.32 40.64,20.95 RL6.1 45.09,20.95 v45.72,21.59 | v49.53,30.48 v63.5,30.48
N$7
  Top 0.457: J1.RX 99.06,36.83 95.25,36.83 93.34,38.73 93.34,48.26 90.17,51.44 R1.1
N$8
  Top 0.457: R5.1 95.25,26.67 95.25,27.94 95.88,28.57 I2C_INT0.SCL
N$9
  Bottom 0.457: RL7.2 65.41,24.13 64.14,22.86 53.34,22.86 50.8,25.4 48.9,25.4 RGB_7-8-13.RED
N$10
  Bottom 0.457: LED5.A 86.99,20.32 86.36,20.95 RL14.1
N$11
  Bottom 0.457: RL8.2 59.05,20.95 57.79,19.68 48.9,19.68 RGB_7-8-13.BLU
N$12
  Bottom 0.457: LED9.A 12.06,59.69 10.79,60.96 RL9.1
N$13
  Bottom 0.457: LED3.A RL3.1
N$14  (via drill 0.61)
  Top 0.457: v49.53,26.67 48.9,27.3 47.62,27.3 47.62,26.67 46.99,26.04 46.99,22.86 48.26,21.59 RGB_7-8-13.GRN
  Bottom 0.457: v49.53,26.67 60.33,26.67 62.23,24.77 RL13.2
N$15
  Bottom 0.457: LED4.A 45.09,59.69 43.82,60.96 RL4.1
N$17  (via drill 0.61)
  Top 0.914: v67.94,29.21 69.85,31.11 IC4.13 69.85,36.2 71.12,36.2 IC4.14 | v36.83,9.53 RGB1_D5-6-11.G | v41.28,9.53 43.18,11.43 43.18,22.23 44.45,23.5 v44.45,25.4
  Bottom 0.914: 43.5,26.35 46.36,29.21 v67.94,29.21 | 43.5,26.35 41.28,24.13 RL11.1 | v41.28,9.53 v36.83,9.53 | 43.5,26.35 v44.45,25.4
N$18  (via drill 0.61)
  Top 0.914: 53.02,63.18 53.34,63.5 53.34,66.67 52.07,67.94 50.17,67.94 D4_IO3.PWM | 53.02,63.18 LED4.K | v54.61,49.53 53.34,50.8 53.34,62.87 53.02,63.18
  Bottom 0.914: IC2.18 60.96,45.09 59.69,45.09 IC2.17 59.69,49.53 v54.61,49.53
N$19  (via drill 0.61)
  Top 0.914: v65.41,19.68 64.77,20.32 64.77,22.23 | v64.77,30.48 64.77,22.23 | v67.31,30.48 IC4.11 67.31,36.2 68.58,36.2 IC4.12 | v46.36,6.99 RGB2_D7-8-13.R | v55.88,9.53 v55.88,6.99 | v58.42,10.16 59.69,11.43 59.69,17.14 64.77,22.23
  Bottom 0.914: v65.41,19.68 RL7.1 | v67.31,30.48 v64.77,30.48 | v55.88,6.99 v46.36,6.99 | v55.88,9.53 56.52,10.16 v58.42,10.16
N$20  (via drill 0.61)
  Top 0.457: v76.83,22.86 73.02,19.05 v73.02,6.35 | v25.4,5.08 25.4,17.78 24.13,19.05 v24.13,33.66
  Bottom 0.457: v76.83,22.86 85.09,22.86 86.36,24.13 RL14.2 | v73.02,6.35 70.48,3.81 26.67,3.81 v25.4,5.08 | v24.13,33.66 26.04,35.56 ARDUINO1.25
N$21
  Bottom 0.457: LED10.A 28.57,59.69 27.3,60.96 RL10.1
N$22  (via drill 0.61)
  Top 0.457: ARDUINO1.26 30.48,36.83 32.38,36.83 33.02,36.2 33.02,34.92 33.66,34.29 35.56,34.29 35.56,53.98 41.28,59.69 41.28,74.3 44.45,77.47 44.45,78.11 45.09,78.74 59.05,78.74 v59.05,77.47
  Bottom 0.457: v59.05,77.47 63.5,77.47 64.77,76.2 97.16,76.2 106.05,67.31 106.05,54.61 107.31,54.61 107.95,53.98 107.95,13.97 SG2.+
N$23
  Bottom 0.457: LED2.A RL2.1
N$24  (via drill 0.61)
  Top 0.914: LED10.K 36.83,63.5 36.83,66.04 | 36.83,66.04 36.83,66.67 34.93,68.58 D10_IO2.PWM | v62.87,57.15 v62.87,42.55 | v69.85,73.66 v69.85,57.78 | v40.01,73.66 40.01,69.22 36.83,66.04
  Bottom 0.914: 55.88,45.09 54.61,45.09 IC2.13 | 55.88,45.09 55.88,42.55 v62.87,42.55 | v62.87,57.15 63.5,57.78 v69.85,57.78 | v40.01,73.66 v69.85,73.66 | 55.88,45.09 IC2.14
N$28
  Bottom 0.457: LED12.A 61.6,59.69 60.33,60.96 RL12.1
N$29  (via drill 0.61)
  Top 0.914: v57.15,8.89 57.15,16.51 v59.05,18.41 59.05,28.57 v62.23,31.75 | v52.71,8.26 48.9,12.06 RGB2_D7-8-13.G | v86.36,48.9 85.09,47.62 v85.09,32.38
  Bottom 0.914: IC1.16 87.63,45.09 86.36,45.09 IC1.15 v86.36,48.9 | v59.05,18.41 59.69,18.41 62.23,20.95 RL13.1 | v57.15,8.89 56.52,8.26 v52.71,8.26 | v85.09,32.38 84.45,31.75 v62.23,31.75
N$35  (via drill 0.61)
  Top 0.914: D3_IO6.PWM 100.96,68.58 102.87,66.67 v102.87,59.69 102.87,44.45 v100.33,41.91
  Bottom 0.914: 82.55,45.09 81.28,45.09 IC1.11 | v102.87,59.69 LED1.K | 82.55,45.09 82.55,41.91 v100.33,41.91 | 82.55,45.09 IC1.12
N$38
  Bottom 0.457: LED0.A 78.1,59.69 76.83,60.96 RL0.1
N$40  (via drill 0.61)
  Top 0.914: 84.14,61.28 86.36,63.5 86.36,66.67 84.45,68.58 D2_IO5.PWM | 84.14,61.28 LED0.K | v83.82,49.53 84.45,50.16 84.45,60.96 84.14,61.28
  Bottom 0.914: IC1.14 85.09,45.09 83.82,45.09 IC1.13 v83.82,49.53
N$41
  Bottom 0.457: LED1.A 94.61,59.69 93.34,60.96 RL1.1
N$42  (via drill 0.61)
  Top 0.914: LED9.K 10.16,66.04 10.16,71.75 14.61,76.2 17.14,76.2 17.14,69.85 | D9_IO1.PWM 17.14,69.85 | v52.71,49.53 52.07,50.16 v52.07,54.61 | v20.32,53.34 20.32,66.67 17.14,69.85
  Bottom 0.914: IC2.16 58.42,45.09 57.15,45.09 IC2.15 57.15,48.26 53.98,48.26 v52.71,49.53 | v52.07,54.61 29.21,54.61 27.94,53.34 v20.32,53.34
N$44  (via drill 0.61)
  Top 0.914: v71.12,68.58 v71.12,60.33 | v44.45,48.26 42.55,50.16 v42.55,72.39
  Bottom 0.914: 52.07,45.09 53.34,45.09 IC2.12 | LED12.K 66.67,60.33 v71.12,60.33 | D12_IO4.PWM v71.12,68.58 73.02,68.58 73.02,70.48 71.12,72.39 v42.55,72.39 | 52.07,45.09 52.07,42.55 50.17,42.55 v44.45,48.26 | 52.07,45.09 IC2.11
RX  (via drill 0.61)
  Top 0.457: v91.44,67.94 91.44,52.7 92.71,51.44 R1.2 | v50.17,64.14 48.26,62.23 48.26,48.9 45.09,45.72 36.83,45.72 ARDUINO1.2
  Bottom 0.457: v91.44,67.94 90.8,67.31 50.8,67.31 50.17,66.67 v50.17,64.14
SCL  (via drill 0.61)
  Top 0.457: R5.2 88.27,26.67 87.63,26.04 87.63,15.24 82.55,15.24 81.91,15.88 81.91,26.67 R6.1 82.55,26.67 83.82,27.94 83.82,31.75 80.64,34.92 80.64,50.8 81.28,51.44 81.28,60.33 80.64,60.96 80.64,66.67 81.91,67.94 81.91,76.83 v82.55,77.47 | ARDUINO1.24 22.86,36.83 22.86,64.14 27.3,68.58 v27.3,76.2
  Bottom 0.457: v27.3,76.2 29.84,78.74 81.28,78.74 v82.55,77.47
SDA  (via drill 0.61)
  Top 0.457: 80.01,27.94 80.01,17.78 79.38,17.14 79.38,15.88 80.64,14.61 80.64,13.34 81.28,12.7 88.9,12.7 88.9,24.13 90.17,25.4 90.17,29.21 91.44,30.48 R2.2 | 80.01,27.94 80.01,28.57 81.91,30.48 R7.1 | v47.62,38.73 55.88,30.48 v55.88,27.94 | 80.01,27.94 v80.64,27.94
  Bottom 0.457: ARDUINO1.23 24.77,38.73 v47.62,38.73 | v80.64,27.94 v55.88,27.94
TX  (via drill 0.61)
  Top 0.457: v43.82,50.8 43.82,65.41 46.36,67.94 46.36,71.75 55.25,71.75 60.33,76.83 60.33,78.74 83.19,78.74 92.71,69.22 92.71,54.61 R3.2
  Bottom 0.457: ARDUINO1.1 v43.82,50.8

### Text on the board
tPlace: Nano V2.2